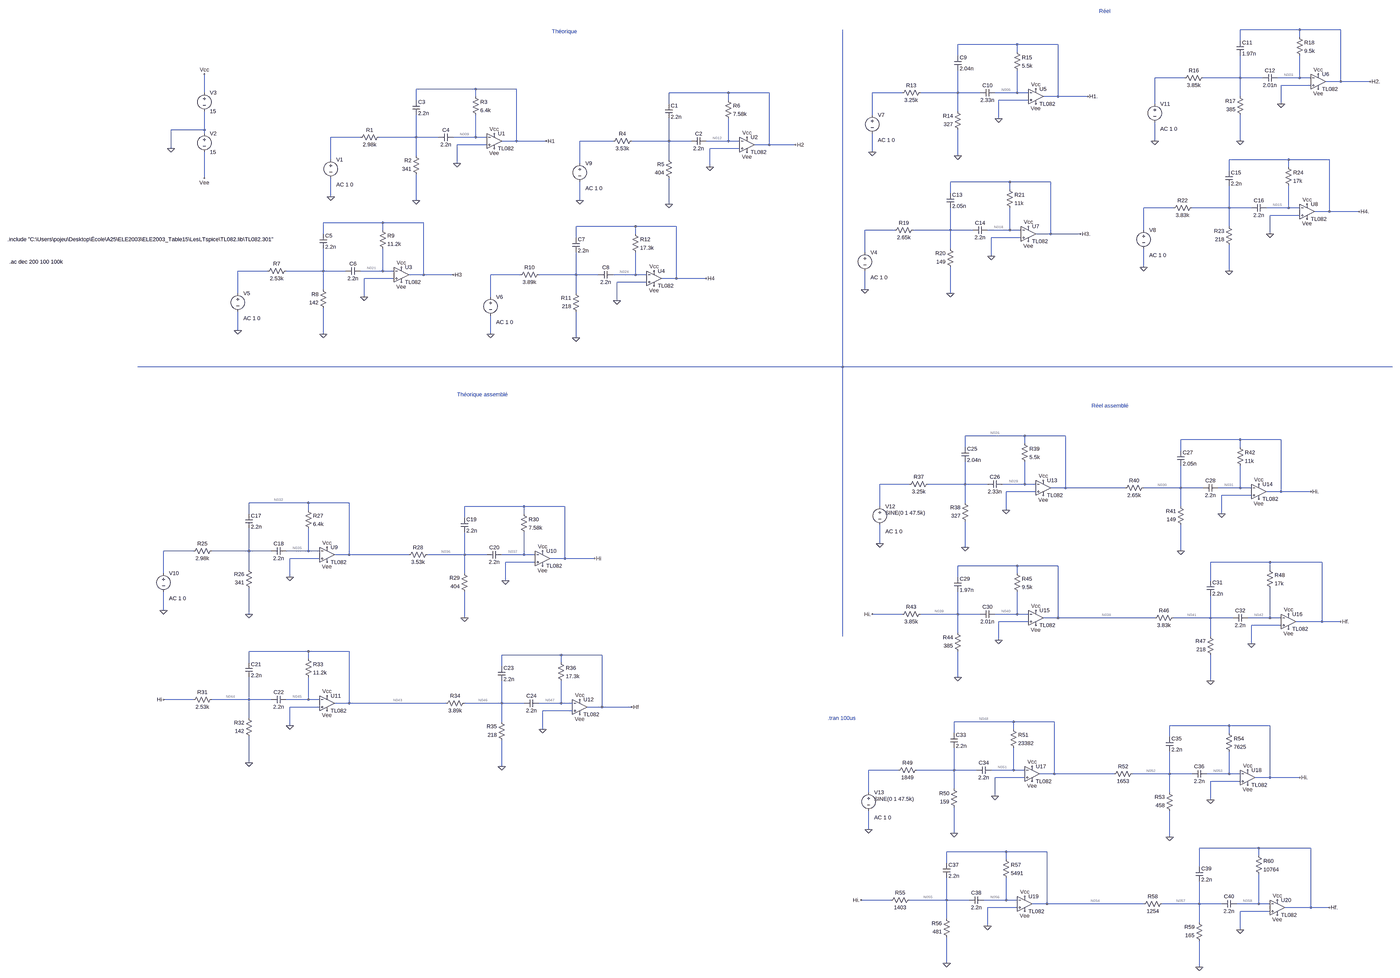
[diagram p0: schematic Filtres separes_F_wizard.asc, whole sheet]
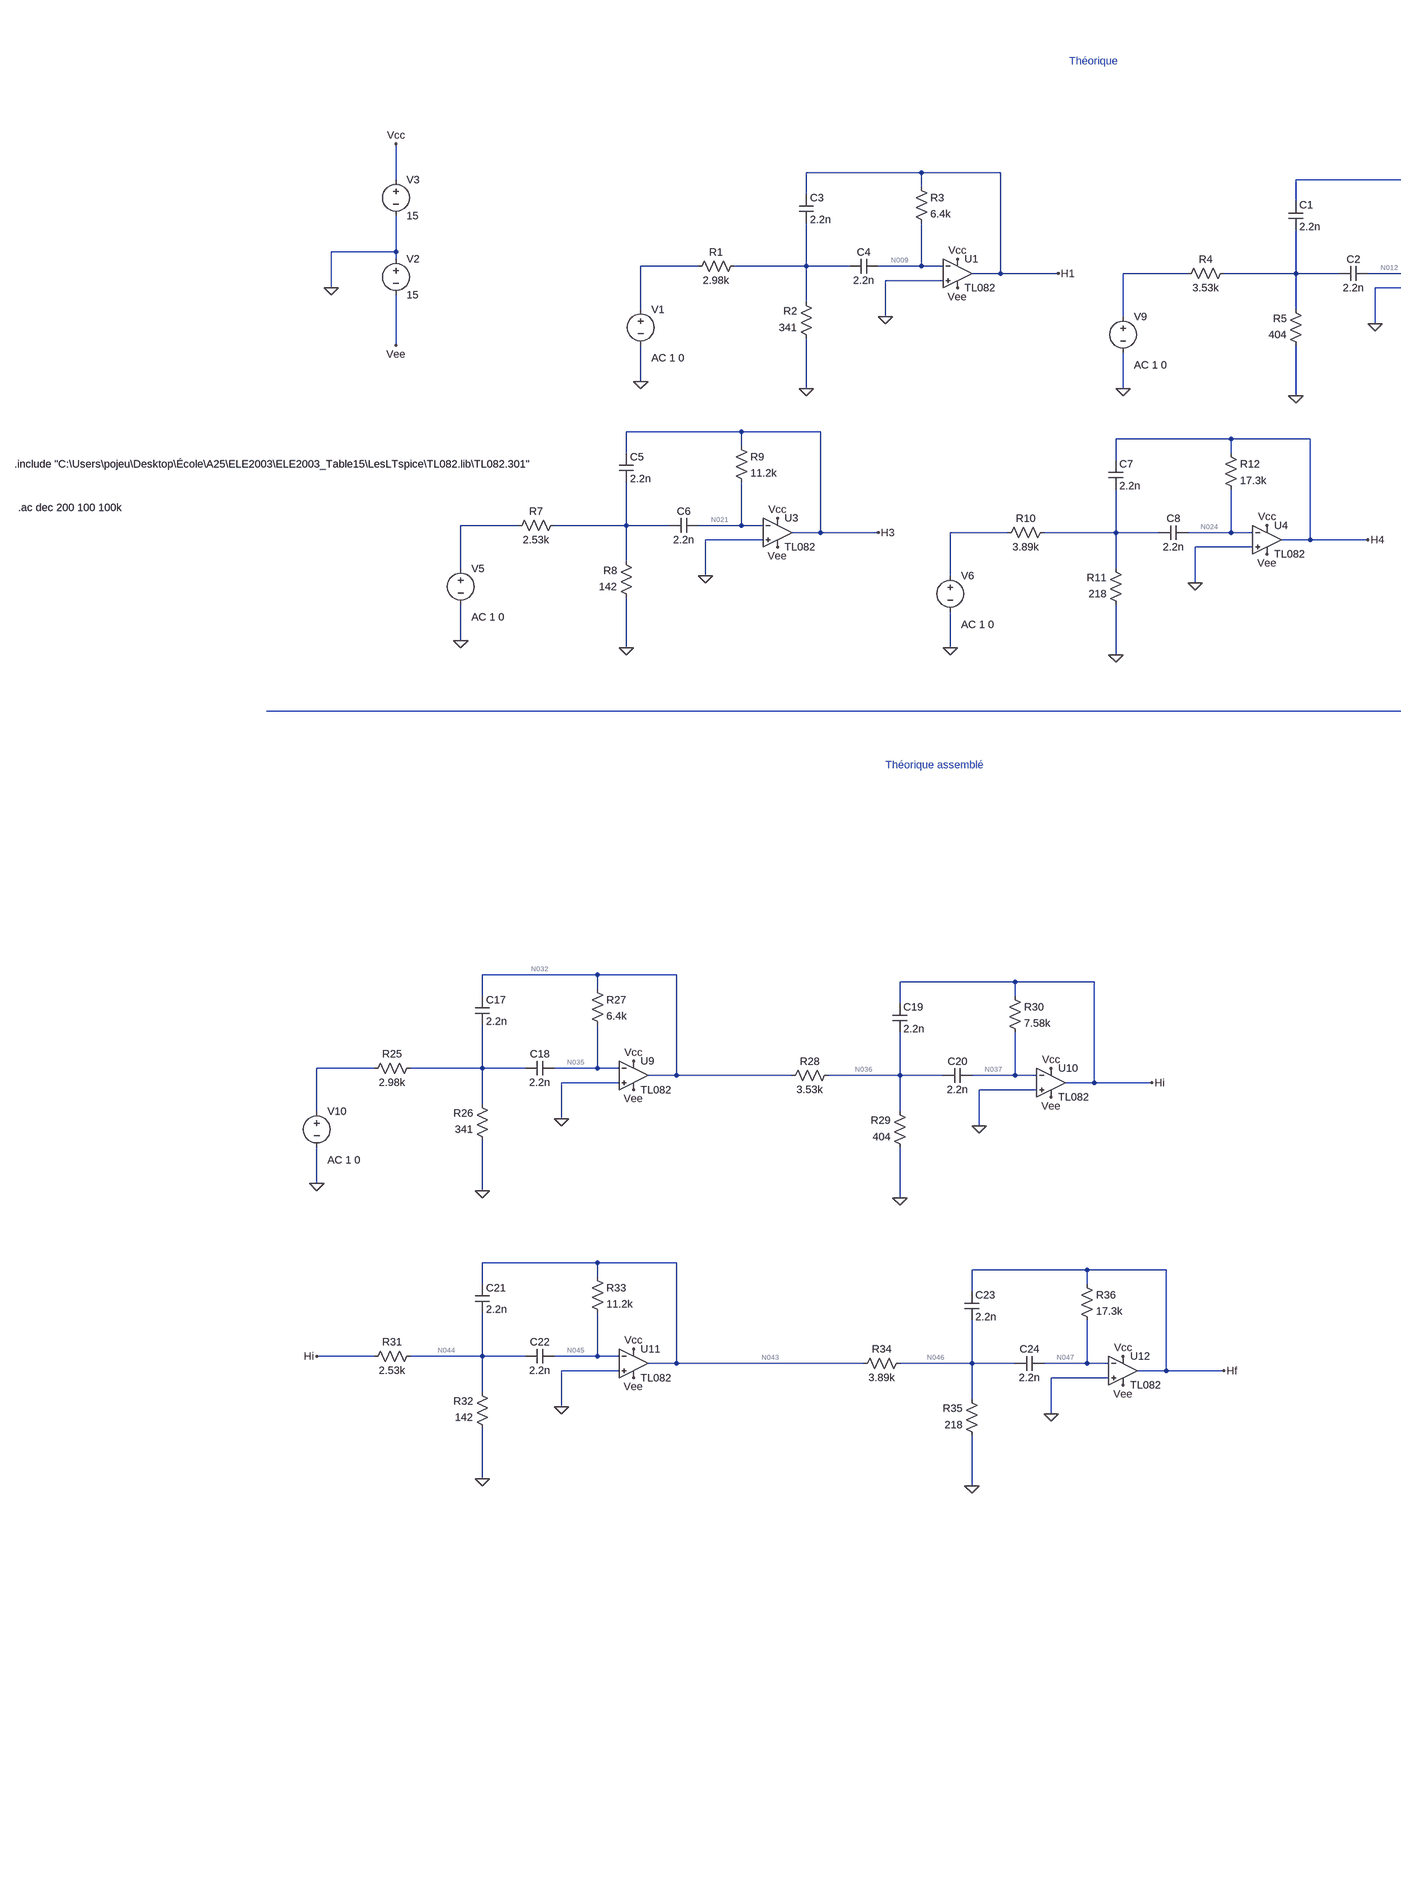
[diagram p1: schematic Filtres separes_F_wizard.asc, part, row 1 of 1, column 1 of 2]
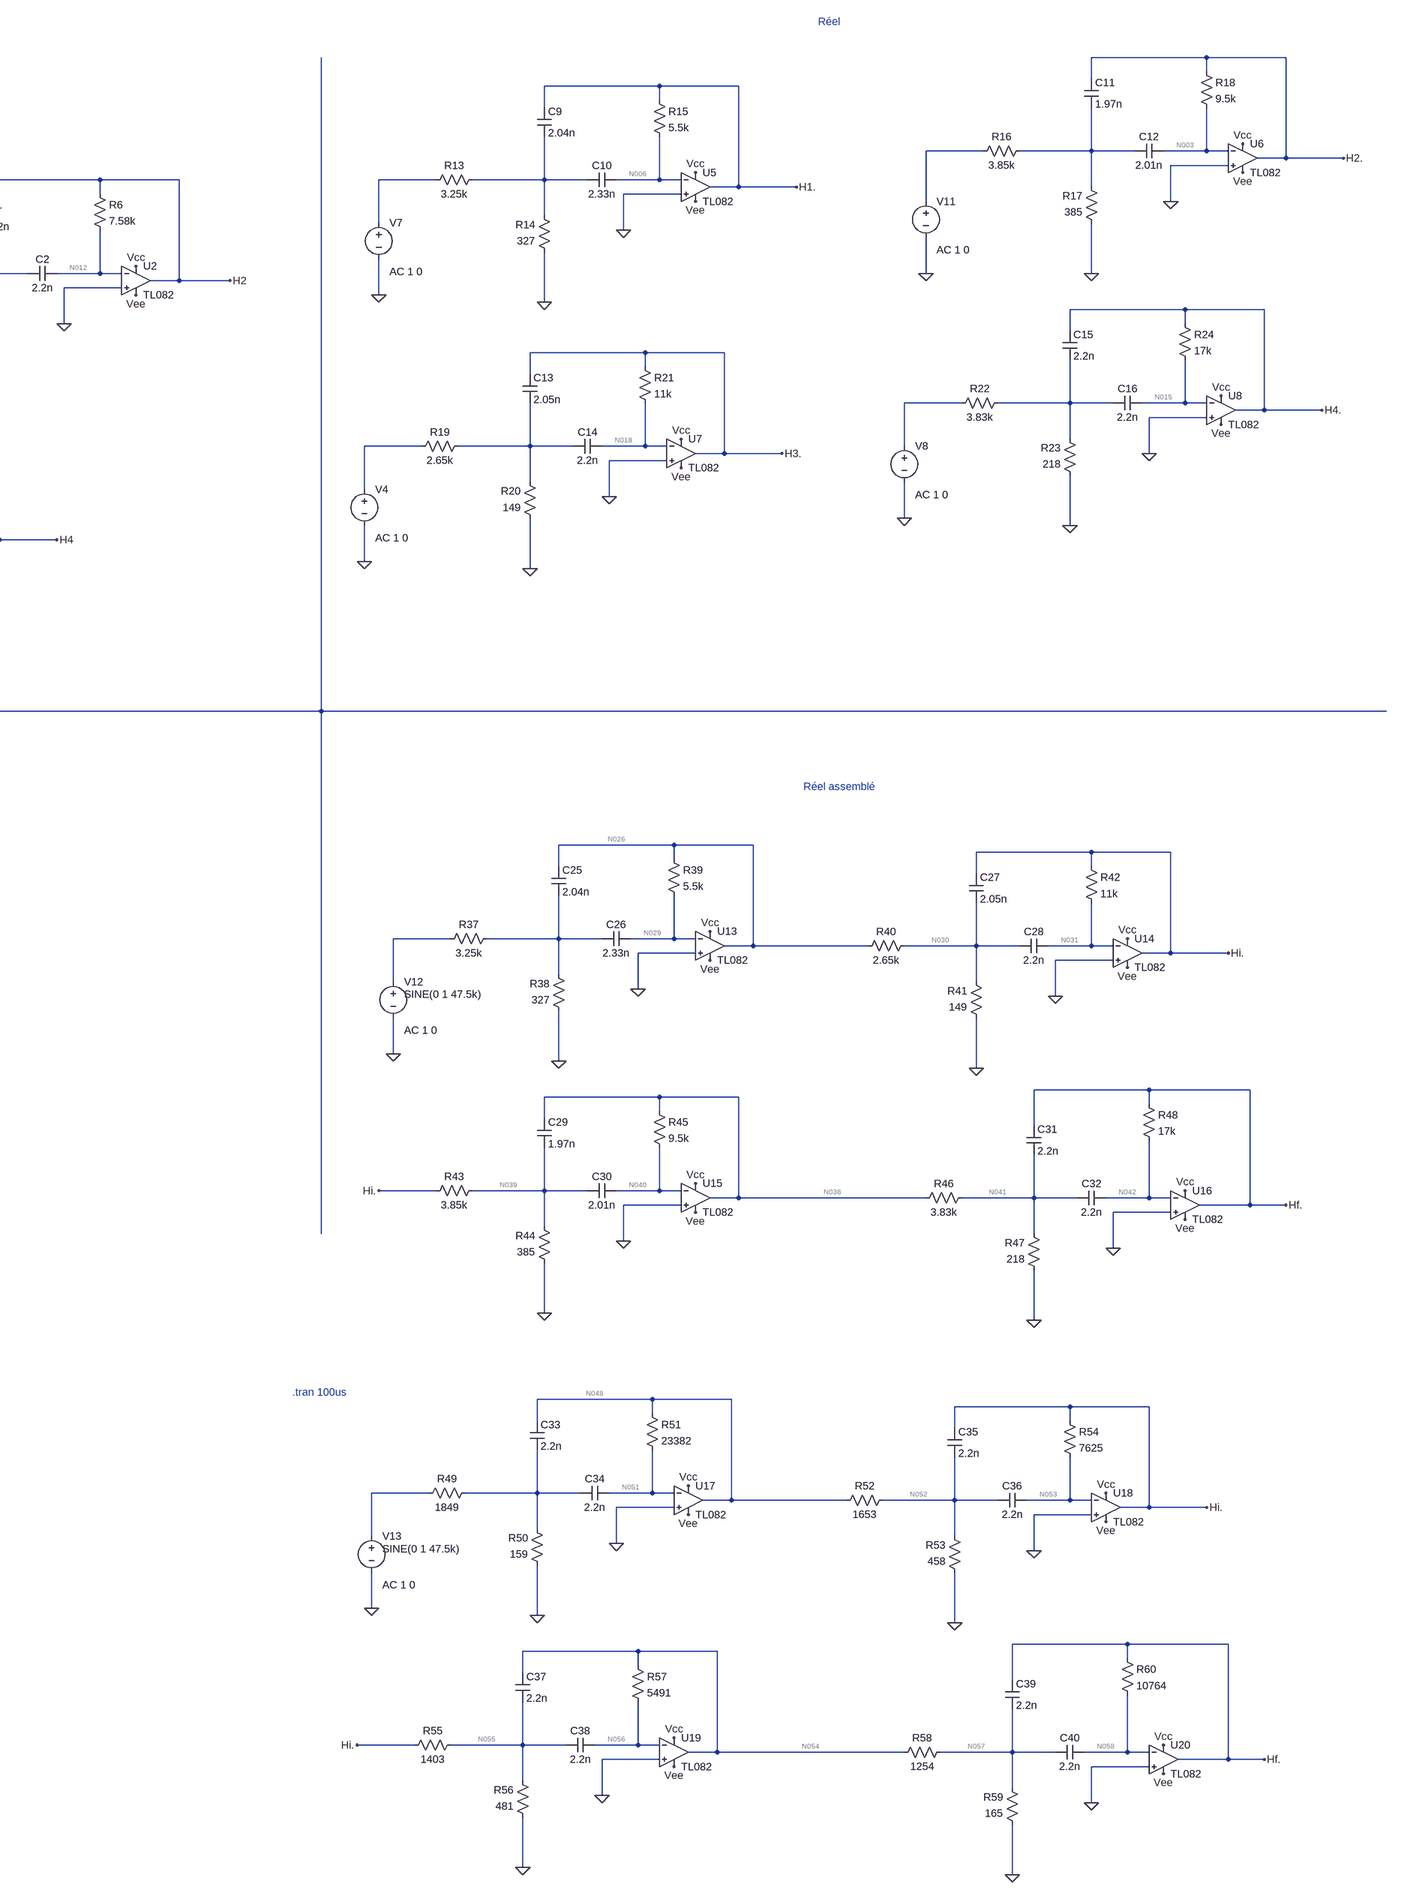
[diagram p2: schematic Filtres separes_F_wizard.asc, part, row 1 of 1, column 2 of 2]
Filtres separes_F_wizard.asc, the LTspice schematic file:
Version 4.1
SHEET 1 5816 3972
WIRE 4368 -288 4112 -288
WIRE 4544 -288 4368 -288
WIRE 4368 -256 4368 -288
WIRE 4112 -240 4112 -288
WIRE 3152 -224 2896 -224
WIRE 3328 -224 3152 -224
WIRE 3152 -192 3152 -224
WIRE 2896 -176 2896 -224
WIRE 3872 -80 3744 -80
WIRE 4112 -80 4112 -176
WIRE 4112 -80 3952 -80
WIRE 4208 -80 4112 -80
WIRE 4368 -80 4368 -176
WIRE 4368 -80 4272 -80
WIRE 4416 -80 4368 -80
WIRE 4544 -64 4544 -288
WIRE 4544 -64 4480 -64
WIRE 4672 -64 4544 -64
WIRE 4416 -48 4288 -48
WIRE 592 -32 336 -32
WIRE 768 -32 592 -32
WIRE -576 -16 -576 -96
WIRE 1680 -16 1424 -16
WIRE 1856 -16 1680 -16
WIRE 2656 -16 2528 -16
WIRE 2896 -16 2896 -112
WIRE 2896 -16 2736 -16
WIRE 2992 -16 2896 -16
WIRE 3152 -16 3152 -112
WIRE 3152 -16 3056 -16
WIRE 3200 -16 3152 -16
WIRE 592 0 592 -32
WIRE 3328 0 3328 -224
WIRE 3328 0 3264 0
WIRE 3456 0 3328 0
WIRE 4112 0 4112 -80
WIRE 336 16 336 -32
WIRE 1680 16 1680 -16
WIRE 3200 16 3072 16
WIRE 1424 32 1424 -16
WIRE 3744 32 3744 -80
WIRE 4288 32 4288 -48
WIRE 2896 64 2896 -16
WIRE 2528 80 2528 -16
WIRE 3072 96 3072 16
WIRE -576 144 -576 64
WIRE -576 144 -720 144
WIRE -576 160 -576 144
WIRE 96 176 -32 176
WIRE 336 176 336 80
WIRE 336 176 176 176
WIRE 432 176 336 176
WIRE 592 176 592 80
WIRE 592 176 496 176
WIRE 640 176 592 176
WIRE 768 192 768 -32
WIRE 768 192 704 192
WIRE 896 192 768 192
WIRE 1184 192 1040 192
WIRE 1424 192 1424 96
WIRE 1424 192 1264 192
WIRE 1520 192 1424 192
WIRE 1680 192 1680 96
WIRE 1680 192 1584 192
WIRE 1728 192 1680 192
WIRE 3744 192 3744 112
WIRE 4112 192 4112 80
WIRE 640 208 512 208
WIRE 1856 208 1856 -16
WIRE 1856 208 1792 208
WIRE 1984 208 1856 208
WIRE -720 224 -720 144
WIRE 1728 224 1600 224
WIRE 2528 240 2528 160
WIRE 336 256 336 176
WIRE 2896 256 2896 144
WIRE -32 272 -32 176
WIRE 1424 272 1424 192
WIRE 4320 272 4064 272
WIRE 4496 272 4320 272
WIRE 512 288 512 208
WIRE 1040 288 1040 192
WIRE 1600 304 1600 224
WIRE 4320 304 4320 272
WIRE 4064 320 4064 272
WIRE -576 352 -576 240
WIRE 3120 368 2864 368
WIRE 3296 368 3120 368
WIRE 3120 400 3120 368
WIRE 2864 416 2864 368
WIRE -32 432 -32 352
WIRE 336 448 336 336
WIRE 1040 448 1040 368
WIRE 1424 464 1424 352
WIRE 3824 480 3696 480
WIRE 4064 480 4064 384
WIRE 4064 480 3904 480
WIRE 4160 480 4064 480
WIRE 4320 480 4320 384
WIRE 4320 480 4224 480
WIRE 4368 480 4320 480
WIRE 4496 496 4496 272
WIRE 4496 496 4432 496
WIRE 4624 496 4496 496
WIRE 4368 512 4240 512
WIRE 192 544 -64 544
WIRE 368 544 192 544
WIRE 1280 560 1024 560
WIRE 1456 560 1280 560
WIRE 4064 560 4064 480
WIRE 192 576 192 544
WIRE 2624 576 2496 576
WIRE 2864 576 2864 480
WIRE 2864 576 2704 576
WIRE 2960 576 2864 576
WIRE 3120 576 3120 480
WIRE 3120 576 3024 576
WIRE 3168 576 3120 576
WIRE 3696 576 3696 480
WIRE -64 592 -64 544
WIRE 1280 592 1280 560
WIRE 3296 592 3296 368
WIRE 3296 592 3232 592
WIRE 3424 592 3296 592
WIRE 4240 592 4240 512
WIRE 1024 608 1024 560
WIRE 3168 608 3040 608
WIRE 2864 656 2864 576
WIRE 2496 672 2496 576
WIRE 3040 688 3040 608
WIRE 3696 736 3696 656
WIRE -304 752 -432 752
WIRE -64 752 -64 656
WIRE -64 752 -224 752
WIRE 32 752 -64 752
WIRE 192 752 192 656
WIRE 192 752 96 752
WIRE 240 752 192 752
WIRE 4064 752 4064 640
WIRE 368 768 368 544
WIRE 368 768 304 768
WIRE 496 768 368 768
WIRE 784 768 656 768
WIRE 1024 768 1024 672
WIRE 1024 768 864 768
WIRE 1120 768 1024 768
WIRE 1280 768 1280 672
WIRE 1280 768 1184 768
WIRE 1328 768 1280 768
WIRE 240 784 112 784
WIRE 1456 784 1456 560
WIRE 1456 784 1392 784
WIRE 1584 784 1456 784
WIRE 1328 800 1200 800
WIRE -64 832 -64 752
WIRE 2496 832 2496 752
WIRE -432 848 -432 752
WIRE 1024 848 1024 768
WIRE 2864 848 2864 736
WIRE 112 864 112 784
WIRE 656 864 656 768
WIRE 1200 880 1200 800
WIRE -432 1008 -432 928
WIRE -64 1024 -64 912
WIRE 656 1024 656 944
WIRE 1024 1040 1024 928
WIRE 2400 1328 2400 -288
WIRE 2400 1328 -864 1328
WIRE 4768 1328 2400 1328
WIRE 3184 1664 2928 1664
WIRE 3360 1664 3184 1664
WIRE 4112 1680 3856 1680
WIRE 4288 1680 4112 1680
WIRE 3184 1696 3184 1664
WIRE 2928 1712 2928 1664
WIRE 4112 1712 4112 1680
WIRE 3856 1728 3856 1680
WIRE 2688 1872 2560 1872
WIRE 2928 1872 2928 1776
WIRE 2928 1872 2768 1872
WIRE 3024 1872 2928 1872
WIRE 3184 1872 3184 1776
WIRE 3184 1872 3088 1872
WIRE 3232 1872 3184 1872
WIRE 3360 1888 3360 1664
WIRE 3360 1888 3296 1888
WIRE 3616 1888 3360 1888
WIRE 3856 1888 3856 1792
WIRE 3856 1888 3696 1888
WIRE 3952 1888 3856 1888
WIRE 4112 1888 4112 1792
WIRE 4112 1888 4016 1888
WIRE 4160 1888 4112 1888
WIRE 3232 1904 3104 1904
WIRE 4288 1904 4288 1680
WIRE 4288 1904 4224 1904
WIRE 4416 1904 4288 1904
WIRE 4160 1920 4032 1920
WIRE -128 1952 -384 1952
WIRE 48 1952 -128 1952
WIRE 2928 1952 2928 1872
WIRE 800 1968 544 1968
WIRE 976 1968 800 1968
WIRE 2560 1968 2560 1872
WIRE 3856 1968 3856 1888
WIRE -128 1984 -128 1952
WIRE 3104 1984 3104 1904
WIRE -384 2000 -384 1952
WIRE 800 2000 800 1968
WIRE 4032 2000 4032 1920
WIRE 544 2016 544 1968
WIRE 2560 2128 2560 2048
WIRE 2928 2144 2928 2032
WIRE -624 2160 -752 2160
WIRE -384 2160 -384 2064
WIRE -384 2160 -544 2160
WIRE -288 2160 -384 2160
WIRE -128 2160 -128 2064
WIRE -128 2160 -224 2160
WIRE -80 2160 -128 2160
WIRE 3856 2160 3856 2048
WIRE 48 2176 48 1952
WIRE 48 2176 -16 2176
WIRE 304 2176 48 2176
WIRE 544 2176 544 2080
WIRE 544 2176 384 2176
WIRE 640 2176 544 2176
WIRE 800 2176 800 2080
WIRE 800 2176 704 2176
WIRE 848 2176 800 2176
WIRE -80 2192 -208 2192
WIRE 976 2192 976 1968
WIRE 976 2192 912 2192
WIRE 1104 2192 976 2192
WIRE 848 2208 720 2208
WIRE 4240 2208 3984 2208
WIRE 4464 2208 4240 2208
WIRE 3152 2224 2896 2224
WIRE 3328 2224 3152 2224
WIRE -384 2240 -384 2160
WIRE 4240 2240 4240 2208
WIRE -752 2256 -752 2160
WIRE 544 2256 544 2176
WIRE 3152 2256 3152 2224
WIRE -208 2272 -208 2192
WIRE 2896 2272 2896 2224
WIRE 720 2288 720 2208
WIRE 3984 2288 3984 2208
WIRE -752 2416 -752 2336
WIRE -384 2432 -384 2320
WIRE 2656 2432 2528 2432
WIRE 2896 2432 2896 2336
WIRE 2896 2432 2736 2432
WIRE 2992 2432 2896 2432
WIRE 3152 2432 3152 2336
WIRE 3152 2432 3056 2432
WIRE 3200 2432 3152 2432
WIRE 544 2448 544 2336
WIRE 3328 2448 3328 2224
WIRE 3328 2448 3264 2448
WIRE 3744 2448 3328 2448
WIRE 3984 2448 3984 2352
WIRE 3984 2448 3824 2448
WIRE 4080 2448 3984 2448
WIRE 4240 2448 4240 2320
WIRE 4240 2448 4144 2448
WIRE 4288 2448 4240 2448
WIRE 3200 2464 3072 2464
WIRE 4464 2464 4464 2208
WIRE 4464 2464 4352 2464
WIRE 4544 2464 4464 2464
WIRE 4288 2480 4160 2480
WIRE 2896 2512 2896 2432
WIRE 2400 2528 2400 1328
WIRE 3984 2528 3984 2448
WIRE 3072 2544 3072 2464
WIRE 4160 2560 4160 2480
WIRE -128 2592 -384 2592
WIRE 48 2592 -128 2592
WIRE 960 2608 704 2608
WIRE 1136 2608 960 2608
WIRE -128 2624 -128 2592
WIRE -384 2640 -384 2592
WIRE 960 2640 960 2608
WIRE 704 2656 704 2608
WIRE 2896 2704 2896 2592
WIRE 3984 2720 3984 2608
WIRE -624 2800 -752 2800
WIRE -384 2800 -384 2704
WIRE -384 2800 -544 2800
WIRE -288 2800 -384 2800
WIRE -128 2800 -128 2704
WIRE -128 2800 -224 2800
WIRE -80 2800 -128 2800
WIRE 48 2816 48 2592
WIRE 48 2816 -16 2816
WIRE 464 2816 48 2816
WIRE 704 2816 704 2720
WIRE 704 2816 544 2816
WIRE 800 2816 704 2816
WIRE 960 2816 960 2720
WIRE 960 2816 864 2816
WIRE 1008 2816 960 2816
WIRE -80 2832 -208 2832
WIRE 1136 2832 1136 2608
WIRE 1136 2832 1072 2832
WIRE 1264 2832 1136 2832
WIRE 1008 2848 880 2848
WIRE -384 2880 -384 2800
WIRE 704 2896 704 2816
WIRE 3136 2896 2880 2896
WIRE 3312 2896 3136 2896
WIRE -208 2912 -208 2832
WIRE 4064 2912 3808 2912
WIRE 4240 2912 4064 2912
WIRE 880 2928 880 2848
WIRE 3136 2928 3136 2896
WIRE 2880 2944 2880 2896
WIRE 4064 2944 4064 2912
WIRE 3808 2960 3808 2912
WIRE -384 3072 -384 2960
WIRE 704 3088 704 2976
WIRE 2640 3104 2512 3104
WIRE 2880 3104 2880 3008
WIRE 2880 3104 2720 3104
WIRE 2976 3104 2880 3104
WIRE 3136 3104 3136 3008
WIRE 3136 3104 3040 3104
WIRE 3184 3104 3136 3104
WIRE 3312 3120 3312 2896
WIRE 3312 3120 3248 3120
WIRE 3568 3120 3312 3120
WIRE 3808 3120 3808 3024
WIRE 3808 3120 3648 3120
WIRE 3904 3120 3808 3120
WIRE 4064 3120 4064 3024
WIRE 4064 3120 3968 3120
WIRE 4112 3120 4064 3120
WIRE 3184 3136 3056 3136
WIRE 4240 3136 4240 2912
WIRE 4240 3136 4176 3136
WIRE 4368 3136 4240 3136
WIRE 4112 3152 3984 3152
WIRE 2880 3184 2880 3104
WIRE 2512 3200 2512 3104
WIRE 3808 3200 3808 3120
WIRE 3056 3216 3056 3136
WIRE 3984 3232 3984 3152
WIRE 2512 3360 2512 3280
WIRE 2880 3376 2880 3264
WIRE 3808 3392 3808 3280
WIRE 4192 3440 3936 3440
WIRE 4416 3440 4192 3440
WIRE 3104 3456 2848 3456
WIRE 3280 3456 3104 3456
WIRE 4192 3472 4192 3440
WIRE 3104 3488 3104 3456
WIRE 2848 3504 2848 3456
WIRE 3936 3520 3936 3440
WIRE 2608 3664 2480 3664
WIRE 2848 3664 2848 3568
WIRE 2848 3664 2688 3664
WIRE 2944 3664 2848 3664
WIRE 3104 3664 3104 3568
WIRE 3104 3664 3008 3664
WIRE 3152 3664 3104 3664
WIRE 3280 3680 3280 3456
WIRE 3280 3680 3216 3680
WIRE 3696 3680 3280 3680
WIRE 3936 3680 3936 3584
WIRE 3936 3680 3776 3680
WIRE 4032 3680 3936 3680
WIRE 4192 3680 4192 3552
WIRE 4192 3680 4096 3680
WIRE 4240 3680 4192 3680
WIRE 3152 3696 3024 3696
WIRE 4416 3696 4416 3440
WIRE 4416 3696 4304 3696
WIRE 4496 3696 4416 3696
WIRE 4240 3712 4112 3712
WIRE 2848 3744 2848 3664
WIRE 3936 3760 3936 3680
WIRE 3024 3776 3024 3696
WIRE 4112 3792 4112 3712
WIRE 2848 3936 2848 3824
WIRE 3936 3952 3936 3840
FLAG 336 448 0
FLAG -32 432 0
FLAG -720 224 0
FLAG -576 -96 Vcc
FLAG -576 352 Vee
FLAG 672 160 Vcc
FLAG 672 224 Vee
FLAG 512 288 0
FLAG 1424 464 0
FLAG 1760 176 Vcc
FLAG 1760 240 Vee
FLAG 1600 304 0
FLAG -64 1024 0
FLAG -432 1008 0
FLAG 272 736 Vcc
FLAG 272 800 Vee
FLAG 112 864 0
FLAG 1024 1040 0
FLAG 656 1024 0
FLAG 1360 752 Vcc
FLAG 1360 816 Vee
FLAG 1200 880 0
FLAG 896 192 H1
FLAG 1984 208 H2
FLAG 496 768 H3
FLAG 1584 784 H4
FLAG 2896 256 0
FLAG 2528 240 0
FLAG 3232 -32 Vcc
FLAG 3232 32 Vee
FLAG 3072 96 0
FLAG 3456 0 H1.
FLAG 4112 192 0
FLAG 4448 -96 Vcc
FLAG 4448 -32 Vee
FLAG 4288 32 0
FLAG 4672 -64 H2.
FLAG 2864 848 0
FLAG 2496 832 0
FLAG 3200 560 Vcc
FLAG 3200 624 Vee
FLAG 3040 688 0
FLAG 3424 592 H3.
FLAG 4064 752 0
FLAG 3696 736 0
FLAG 4400 464 Vcc
FLAG 4400 528 Vee
FLAG 4240 592 0
FLAG 4624 496 H4.
FLAG 1040 448 0
FLAG -384 2432 0
FLAG -752 2416 0
FLAG -48 2144 Vcc
FLAG -48 2208 Vee
FLAG -208 2272 0
FLAG 544 2448 0
FLAG 880 2160 Vcc
FLAG 880 2224 Vee
FLAG 720 2288 0
FLAG 1104 2192 Hi
FLAG -384 3072 0
FLAG -48 2784 Vcc
FLAG -48 2848 Vee
FLAG -208 2912 0
FLAG 704 3088 0
FLAG 1040 2800 Vcc
FLAG 1040 2864 Vee
FLAG 880 2928 0
FLAG 1264 2832 Hf
FLAG 3744 192 0
FLAG 2928 2144 0
FLAG 2560 2128 0
FLAG 3264 1856 Vcc
FLAG 3264 1920 Vee
FLAG 3104 1984 0
FLAG 3856 2160 0
FLAG 4192 1872 Vcc
FLAG 4192 1936 Vee
FLAG 4032 2000 0
FLAG 4416 1904 Hi.
FLAG 2896 2704 0
FLAG 3232 2416 Vcc
FLAG 3232 2480 Vee
FLAG 3072 2544 0
FLAG 3984 2720 0
FLAG 4320 2432 Vcc
FLAG 4320 2496 Vee
FLAG 4160 2560 0
FLAG 2528 2432 Hi.
FLAG 4544 2464 Hf.
FLAG -752 2800 Hi
FLAG 2880 3376 0
FLAG 2512 3360 0
FLAG 3216 3088 Vcc
FLAG 3216 3152 Vee
FLAG 3056 3216 0
FLAG 3808 3392 0
FLAG 4144 3104 Vcc
FLAG 4144 3168 Vee
FLAG 3984 3232 0
FLAG 4368 3136 Hi.
FLAG 2848 3936 0
FLAG 3184 3648 Vcc
FLAG 3184 3712 Vee
FLAG 3024 3776 0
FLAG 3936 3952 0
FLAG 4272 3664 Vcc
FLAG 4272 3728 Vee
FLAG 4112 3792 0
FLAG 2480 3664 Hi.
FLAG 4496 3696 Hf.
SYMBOL res 192 160 R90
WINDOW 0 0 56 VBottom 2
WINDOW 3 32 56 VTop 2
SYMATTR InstName R1
SYMATTR Value 2.98k
SYMBOL res 352 352 R180
WINDOW 0 36 76 Left 2
WINDOW 3 36 40 Left 2
SYMATTR InstName R2
SYMATTR Value 341
SYMBOL cap 320 16 R0
SYMATTR InstName C3
SYMATTR Value 2.2n
SYMBOL cap 496 160 R90
WINDOW 0 0 32 VBottom 2
WINDOW 3 32 32 VTop 2
SYMATTR InstName C4
SYMATTR Value 2.2n
SYMBOL res 576 -16 R0
SYMATTR InstName R3
SYMATTR Value 6.4k
SYMBOL voltage -32 256 R0
WINDOW 123 24 124 Left 2
WINDOW 39 0 0 Left 0
SYMATTR Value2 AC 1 0
SYMATTR InstName V1
SYMATTR Value ""
SYMBOL voltage -576 144 R0
SYMATTR InstName V2
SYMATTR Value 15
SYMBOL voltage -576 -32 R0
SYMATTR InstName V3
SYMATTR Value 15
SYMBOL OpAmps\\opamp2 672 128 R0
SYMATTR InstName U1
SYMATTR Value TL082
SYMBOL res 1280 176 R90
WINDOW 0 0 56 VBottom 2
WINDOW 3 32 56 VTop 2
SYMATTR InstName R4
SYMATTR Value 3.53k
SYMBOL res 1440 368 R180
WINDOW 0 36 76 Left 2
WINDOW 3 36 40 Left 2
SYMATTR InstName R5
SYMATTR Value 404
SYMBOL cap 1408 32 R0
SYMATTR InstName C1
SYMATTR Value 2.2n
SYMBOL cap 1584 176 R90
WINDOW 0 0 32 VBottom 2
WINDOW 3 32 32 VTop 2
SYMATTR InstName C2
SYMATTR Value 2.2n
SYMBOL res 1664 0 R0
SYMATTR InstName R6
SYMATTR Value 7.58k
SYMBOL OpAmps\\opamp2 1760 144 R0
SYMATTR InstName U2
SYMATTR Value TL082
SYMBOL res -208 736 R90
WINDOW 0 0 56 VBottom 2
WINDOW 3 32 56 VTop 2
SYMATTR InstName R7
SYMATTR Value 2.53k
SYMBOL res -48 928 R180
WINDOW 0 36 76 Left 2
WINDOW 3 36 40 Left 2
SYMATTR InstName R8
SYMATTR Value 142
SYMBOL cap -80 592 R0
SYMATTR InstName C5
SYMATTR Value 2.2n
SYMBOL cap 96 736 R90
WINDOW 0 0 32 VBottom 2
WINDOW 3 32 32 VTop 2
SYMATTR InstName C6
SYMATTR Value 2.2n
SYMBOL res 176 560 R0
SYMATTR InstName R9
SYMATTR Value 11.2k
SYMBOL voltage -432 832 R0
WINDOW 123 24 124 Left 2
WINDOW 39 0 0 Left 0
SYMATTR Value2 AC 1 0
SYMATTR InstName V5
SYMATTR Value ""
SYMBOL OpAmps\\opamp2 272 704 R0
SYMATTR InstName U3
SYMATTR Value TL082
SYMBOL res 880 752 R90
WINDOW 0 0 56 VBottom 2
WINDOW 3 32 56 VTop 2
SYMATTR InstName R10
SYMATTR Value 3.89k
SYMBOL res 1040 944 R180
WINDOW 0 36 76 Left 2
WINDOW 3 36 40 Left 2
SYMATTR InstName R11
SYMATTR Value 218
SYMBOL cap 1008 608 R0
SYMATTR InstName C7
SYMATTR Value 2.2n
SYMBOL cap 1184 752 R90
WINDOW 0 0 32 VBottom 2
WINDOW 3 32 32 VTop 2
SYMATTR InstName C8
SYMATTR Value 2.2n
SYMBOL res 1264 576 R0
SYMATTR InstName R12
SYMATTR Value 17.3k
SYMBOL voltage 656 848 R0
WINDOW 123 24 124 Left 2
WINDOW 39 0 0 Left 0
SYMATTR Value2 AC 1 0
SYMATTR InstName V6
SYMATTR Value ""
SYMBOL OpAmps\\opamp2 1360 720 R0
SYMATTR InstName U4
SYMATTR Value TL082
SYMBOL res 2752 -32 R90
WINDOW 0 0 56 VBottom 2
WINDOW 3 32 56 VTop 2
SYMATTR InstName R13
SYMATTR Value 3.25k
SYMBOL res 2912 160 R180
WINDOW 0 36 76 Left 2
WINDOW 3 36 40 Left 2
SYMATTR InstName R14
SYMATTR Value 327
SYMBOL cap 2880 -176 R0
SYMATTR InstName C9
SYMATTR Value 2.04n
SYMBOL cap 3056 -32 R90
WINDOW 0 0 32 VBottom 2
WINDOW 3 32 32 VTop 2
SYMATTR InstName C10
SYMATTR Value 2.33n
SYMBOL res 3136 -208 R0
SYMATTR InstName R15
SYMATTR Value 5.5k
SYMBOL voltage 2528 64 R0
WINDOW 123 24 124 Left 2
WINDOW 39 0 0 Left 0
SYMATTR Value2 AC 1 0
SYMATTR InstName V7
SYMATTR Value ""
SYMBOL OpAmps\\opamp2 3232 -64 R0
SYMATTR InstName U5
SYMATTR Value TL082
SYMBOL res 3968 -96 R90
WINDOW 0 0 56 VBottom 2
WINDOW 3 32 56 VTop 2
SYMATTR InstName R16
SYMATTR Value 3.85k
SYMBOL res 4128 96 R180
WINDOW 0 36 76 Left 2
WINDOW 3 36 40 Left 2
SYMATTR InstName R17
SYMATTR Value 385
SYMBOL cap 4096 -240 R0
SYMATTR InstName C11
SYMATTR Value 1.97n
SYMBOL cap 4272 -96 R90
WINDOW 0 0 32 VBottom 2
WINDOW 3 32 32 VTop 2
SYMATTR InstName C12
SYMATTR Value 2.01n
SYMBOL res 4352 -272 R0
SYMATTR InstName R18
SYMATTR Value 9.5k
SYMBOL OpAmps\\opamp2 4448 -128 R0
SYMATTR InstName U6
SYMATTR Value TL082
SYMBOL res 2720 560 R90
WINDOW 0 0 56 VBottom 2
WINDOW 3 32 56 VTop 2
SYMATTR InstName R19
SYMATTR Value 2.65k
SYMBOL res 2880 752 R180
WINDOW 0 36 76 Left 2
WINDOW 3 36 40 Left 2
SYMATTR InstName R20
SYMATTR Value 149
SYMBOL cap 2848 416 R0
SYMATTR InstName C13
SYMATTR Value 2.05n
SYMBOL cap 3024 560 R90
WINDOW 0 0 32 VBottom 2
WINDOW 3 32 32 VTop 2
SYMATTR InstName C14
SYMATTR Value 2.2n
SYMBOL res 3104 384 R0
SYMATTR InstName R21
SYMATTR Value 11k
SYMBOL voltage 2496 656 R0
WINDOW 123 24 124 Left 2
WINDOW 39 0 0 Left 0
SYMATTR Value2 AC 1 0
SYMATTR InstName V4
SYMATTR Value ""
SYMBOL OpAmps\\opamp2 3200 528 R0
SYMATTR InstName U7
SYMATTR Value TL082
SYMBOL res 3920 464 R90
WINDOW 0 0 56 VBottom 2
WINDOW 3 32 56 VTop 2
SYMATTR InstName R22
SYMATTR Value 3.83k
SYMBOL res 4080 656 R180
WINDOW 0 36 76 Left 2
WINDOW 3 36 40 Left 2
SYMATTR InstName R23
SYMATTR Value 218
SYMBOL cap 4048 320 R0
SYMATTR InstName C15
SYMATTR Value 2.2n
SYMBOL cap 4224 464 R90
WINDOW 0 0 32 VBottom 2
WINDOW 3 32 32 VTop 2
SYMATTR InstName C16
SYMATTR Value 2.2n
SYMBOL res 4304 288 R0
SYMATTR InstName R24
SYMATTR Value 17k
SYMBOL voltage 3696 560 R0
WINDOW 123 24 124 Left 2
WINDOW 39 0 0 Left 0
SYMATTR Value2 AC 1 0
SYMATTR InstName V8
SYMATTR Value ""
SYMBOL OpAmps\\opamp2 4400 432 R0
SYMATTR InstName U8
SYMATTR Value TL082
SYMBOL voltage 1040 272 R0
WINDOW 123 24 124 Left 2
WINDOW 39 0 0 Left 0
SYMATTR Value2 AC 1 0
SYMATTR InstName V9
SYMATTR Value ""
SYMBOL res -528 2144 R90
WINDOW 0 0 56 VBottom 2
WINDOW 3 32 56 VTop 2
SYMATTR InstName R25
SYMATTR Value 2.98k
SYMBOL res -368 2336 R180
WINDOW 0 36 76 Left 2
WINDOW 3 36 40 Left 2
SYMATTR InstName R26
SYMATTR Value 341
SYMBOL cap -400 2000 R0
SYMATTR InstName C17
SYMATTR Value 2.2n
SYMBOL cap -224 2144 R90
WINDOW 0 0 32 VBottom 2
WINDOW 3 32 32 VTop 2
SYMATTR InstName C18
SYMATTR Value 2.2n
SYMBOL res -144 1968 R0
SYMATTR InstName R27
SYMATTR Value 6.4k
SYMBOL voltage -752 2240 R0
WINDOW 123 24 124 Left 2
WINDOW 39 0 0 Left 0
SYMATTR Value2 AC 1 0
SYMATTR InstName V10
SYMATTR Value ""
SYMBOL OpAmps\\opamp2 -48 2112 R0
SYMATTR InstName U9
SYMATTR Value TL082
SYMBOL res 400 2160 R90
WINDOW 0 0 56 VBottom 2
WINDOW 3 32 56 VTop 2
SYMATTR InstName R28
SYMATTR Value 3.53k
SYMBOL res 560 2352 R180
WINDOW 0 36 76 Left 2
WINDOW 3 36 40 Left 2
SYMATTR InstName R29
SYMATTR Value 404
SYMBOL cap 528 2016 R0
SYMATTR InstName C19
SYMATTR Value 2.2n
SYMBOL cap 704 2160 R90
WINDOW 0 0 32 VBottom 2
WINDOW 3 32 32 VTop 2
SYMATTR InstName C20
SYMATTR Value 2.2n
SYMBOL res 784 1984 R0
SYMATTR InstName R30
SYMATTR Value 7.58k
SYMBOL OpAmps\\opamp2 880 2128 R0
SYMATTR InstName U10
SYMATTR Value TL082
SYMBOL res -528 2784 R90
WINDOW 0 0 56 VBottom 2
WINDOW 3 32 56 VTop 2
SYMATTR InstName R31
SYMATTR Value 2.53k
SYMBOL res -368 2976 R180
WINDOW 0 36 76 Left 2
WINDOW 3 36 40 Left 2
SYMATTR InstName R32
SYMATTR Value 142
SYMBOL cap -400 2640 R0
SYMATTR InstName C21
SYMATTR Value 2.2n
SYMBOL cap -224 2784 R90
WINDOW 0 0 32 VBottom 2
WINDOW 3 32 32 VTop 2
SYMATTR InstName C22
SYMATTR Value 2.2n
SYMBOL res -144 2608 R0
SYMATTR InstName R33
SYMATTR Value 11.2k
SYMBOL OpAmps\\opamp2 -48 2752 R0
SYMATTR InstName U11
SYMATTR Value TL082
SYMBOL res 560 2800 R90
WINDOW 0 0 56 VBottom 2
WINDOW 3 32 56 VTop 2
SYMATTR InstName R34
SYMATTR Value 3.89k
SYMBOL res 720 2992 R180
WINDOW 0 36 76 Left 2
WINDOW 3 36 40 Left 2
SYMATTR InstName R35
SYMATTR Value 218
SYMBOL cap 688 2656 R0
SYMATTR InstName C23
SYMATTR Value 2.2n
SYMBOL cap 864 2800 R90
WINDOW 0 0 32 VBottom 2
WINDOW 3 32 32 VTop 2
SYMATTR InstName C24
SYMATTR Value 2.2n
SYMBOL res 944 2624 R0
SYMATTR InstName R36
SYMATTR Value 17.3k
SYMBOL OpAmps\\opamp2 1040 2768 R0
SYMATTR InstName U12
SYMATTR Value TL082
SYMBOL voltage 3744 16 R0
WINDOW 123 24 124 Left 2
WINDOW 39 0 0 Left 0
SYMATTR Value2 AC 1 0
SYMATTR InstName V11
SYMATTR Value ""
SYMBOL res 2784 1856 R90
WINDOW 0 0 56 VBottom 2
WINDOW 3 32 56 VTop 2
SYMATTR InstName R37
SYMATTR Value 3.25k
SYMBOL res 2944 2048 R180
WINDOW 0 36 76 Left 2
WINDOW 3 36 40 Left 2
SYMATTR InstName R38
SYMATTR Value 327
SYMBOL cap 2912 1712 R0
SYMATTR InstName C25
SYMATTR Value 2.04n
SYMBOL cap 3088 1856 R90
WINDOW 0 0 32 VBottom 2
WINDOW 3 32 32 VTop 2
SYMATTR InstName C26
SYMATTR Value 2.33n
SYMBOL res 3168 1680 R0
SYMATTR InstName R39
SYMATTR Value 5.5k
SYMBOL voltage 2560 1952 R0
WINDOW 123 24 124 Left 2
WINDOW 39 0 0 Left 0
WINDOW 3 24 44 Left 2
SYMATTR Value2 AC 1 0
SYMATTR Value SINE(0 1 47.5k)
SYMATTR InstName V12
SYMBOL OpAmps\\opamp2 3264 1824 R0
SYMATTR InstName U13
SYMATTR Value TL082
SYMBOL res 3712 1872 R90
WINDOW 0 0 56 VBottom 2
WINDOW 3 32 56 VTop 2
SYMATTR InstName R40
SYMATTR Value 2.65k
SYMBOL res 3872 2064 R180
WINDOW 0 36 76 Left 2
WINDOW 3 36 40 Left 2
SYMATTR InstName R41
SYMATTR Value 149
SYMBOL cap 3840 1728 R0
SYMATTR InstName C27
SYMATTR Value 2.05n
SYMBOL cap 4016 1872 R90
WINDOW 0 0 32 VBottom 2
WINDOW 3 32 32 VTop 2
SYMATTR InstName C28
SYMATTR Value 2.2n
SYMBOL res 4096 1696 R0
SYMATTR InstName R42
SYMATTR Value 11k
SYMBOL OpAmps\\opamp2 4192 1840 R0
SYMATTR InstName U14
SYMATTR Value TL082
SYMBOL res 2752 2416 R90
WINDOW 0 0 56 VBottom 2
WINDOW 3 32 56 VTop 2
SYMATTR InstName R43
SYMATTR Value 3.85k
SYMBOL res 2912 2608 R180
WINDOW 0 36 76 Left 2
WINDOW 3 36 40 Left 2
SYMATTR InstName R44
SYMATTR Value 385
SYMBOL cap 2880 2272 R0
SYMATTR InstName C29
SYMATTR Value 1.97n
SYMBOL cap 3056 2416 R90
WINDOW 0 0 32 VBottom 2
WINDOW 3 32 32 VTop 2
SYMATTR InstName C30
SYMATTR Value 2.01n
SYMBOL res 3136 2240 R0
SYMATTR InstName R45
SYMATTR Value 9.5k
SYMBOL OpAmps\\opamp2 3232 2384 R0
SYMATTR InstName U15
SYMATTR Value TL082
SYMBOL res 3840 2432 R90
WINDOW 0 0 56 VBottom 2
WINDOW 3 32 56 VTop 2
SYMATTR InstName R46
SYMATTR Value 3.83k
SYMBOL res 4000 2624 R180
WINDOW 0 36 76 Left 2
WINDOW 3 36 40 Left 2
SYMATTR InstName R47
SYMATTR Value 218
SYMBOL cap 3968 2288 R0
SYMATTR InstName C31
SYMATTR Value 2.2n
SYMBOL cap 4144 2432 R90
WINDOW 0 0 32 VBottom 2
WINDOW 3 32 32 VTop 2
SYMATTR InstName C32
SYMATTR Value 2.2n
SYMBOL OpAmps\\opamp2 4320 2400 R0
SYMATTR InstName U16
SYMATTR Value TL082
SYMBOL res 4224 2224 R0
SYMATTR InstName R48
SYMATTR Value 17k
SYMBOL res 2736 3088 R90
WINDOW 0 0 56 VBottom 2
WINDOW 3 32 56 VTop 2
SYMATTR InstName R49
SYMATTR Value 1849
SYMBOL res 2896 3280 R180
WINDOW 0 36 76 Left 2
WINDOW 3 36 40 Left 2
SYMATTR InstName R50
SYMATTR Value 159
SYMBOL cap 2864 2944 R0
SYMATTR InstName C33
SYMATTR Value 2.2n
SYMBOL cap 3040 3088 R90
WINDOW 0 0 32 VBottom 2
WINDOW 3 32 32 VTop 2
SYMATTR InstName C34
SYMATTR Value 2.2n
SYMBOL res 3120 2912 R0
SYMATTR InstName R51
SYMATTR Value 23382
SYMBOL voltage 2512 3184 R0
WINDOW 123 24 124 Left 2
WINDOW 39 0 0 Left 0
WINDOW 3 24 44 Left 2
SYMATTR Value2 AC 1 0
SYMATTR Value SINE(0 1 47.5k)
SYMATTR InstName V13
SYMBOL OpAmps\\opamp2 3216 3056 R0
SYMATTR InstName U17
SYMATTR Value TL082
SYMBOL res 3664 3104 R90
WINDOW 0 0 56 VBottom 2
WINDOW 3 32 56 VTop 2
SYMATTR InstName R52
SYMATTR Value 1653
SYMBOL res 3824 3296 R180
WINDOW 0 36 76 Left 2
WINDOW 3 36 40 Left 2
SYMATTR InstName R53
SYMATTR Value 458
SYMBOL cap 3792 2960 R0
SYMATTR InstName C35
SYMATTR Value 2.2n
SYMBOL cap 3968 3104 R90
WINDOW 0 0 32 VBottom 2
WINDOW 3 32 32 VTop 2
SYMATTR InstName C36
SYMATTR Value 2.2n
SYMBOL res 4048 2928 R0
SYMATTR InstName R54
SYMATTR Value 7625
SYMBOL OpAmps\\opamp2 4144 3072 R0
SYMATTR InstName U18
SYMATTR Value TL082
SYMBOL res 2704 3648 R90
WINDOW 0 0 56 VBottom 2
WINDOW 3 32 56 VTop 2
SYMATTR InstName R55
SYMATTR Value 1403
SYMBOL res 2864 3840 R180
WINDOW 0 36 76 Left 2
WINDOW 3 36 40 Left 2
SYMATTR InstName R56
SYMATTR Value 481
SYMBOL cap 2832 3504 R0
SYMATTR InstName C37
SYMATTR Value 2.2n
SYMBOL cap 3008 3648 R90
WINDOW 0 0 32 VBottom 2
WINDOW 3 32 32 VTop 2
SYMATTR InstName C38
SYMATTR Value 2.2n
SYMBOL res 3088 3472 R0
SYMATTR InstName R57
SYMATTR Value 5491
SYMBOL OpAmps\\opamp2 3184 3616 R0
SYMATTR InstName U19
SYMATTR Value TL082
SYMBOL res 3792 3664 R90
WINDOW 0 0 56 VBottom 2
WINDOW 3 32 56 VTop 2
SYMATTR InstName R58
SYMATTR Value 1254
SYMBOL res 3952 3856 R180
WINDOW 0 36 76 Left 2
WINDOW 3 36 40 Left 2
SYMATTR InstName R59
SYMATTR Value 165
SYMBOL cap 3920 3520 R0
SYMATTR InstName C39
SYMATTR Value 2.2n
SYMBOL cap 4096 3664 R90
WINDOW 0 0 32 VBottom 2
WINDOW 3 32 32 VTop 2
SYMATTR InstName C40
SYMATTR Value 2.2n
SYMBOL OpAmps\\opamp2 4272 3632 R0
SYMATTR InstName U20
SYMATTR Value TL082
SYMBOL res 4176 3456 R0
SYMATTR InstName R60
SYMATTR Value 10764
TEXT -1424 616 Left 2 !.include "C:\\Users\\pojeu\\Desktop\\École\\A25\\ELE2003\\ELE2003_Table15\\LesLTspice\\TL082.lib\\TL082.301"
TEXT -1416 712 Left 2 !.ac dec 200 100 100k
TEXT 920 -280 Left 2 ;Théorique
TEXT 3504 -368 Left 2 ;Réel
TEXT 512 1456 Left 2 ;Théorique assemblé
TEXT 3472 1504 Left 2 ;Réel assemblé
TEXT 2336 2880 Left 2 ;.tran 100us

The netlist it stands for:
* Filtres separes_F_wizard.asc
R1 N008 N007 2.98k
R2 0 N008 341
C3 H1 N008 2.2n
C4 N009 N008 2.2n
R3 H1 N009 6.4k
V1 N007 0 AC 1 0
V2 0 Vee 15
V3 Vcc 0 15
X§U1 0 N009 Vcc Vee H1 TL082  ; pins In+ In- V+ V- OUT
R4 N011 N010 3.53k
R5 0 N011 404
C1 H2 N011 2.2n
C2 N012 N011 2.2n
R6 H2 N012 7.58k
X§U2 0 N012 Vcc Vee H2 TL082  ; pins In+ In- V+ V- OUT
R7 N020 N019 2.53k
R8 0 N020 142
C5 H3 N020 2.2n
C6 N021 N020 2.2n
R9 H3 N021 11.2k
V5 N019 0 AC 1 0
X§U3 0 N021 Vcc Vee H3 TL082  ; pins In+ In- V+ V- OUT
R10 N023 N022 3.89k
R11 0 N023 218
C7 H4 N023 2.2n
C8 N024 N023 2.2n
R12 H4 N024 17.3k
V6 N022 0 AC 1 0
X§U4 0 N024 Vcc Vee H4 TL082  ; pins In+ In- V+ V- OUT
R13 N005 N004 3.25k
R14 0 N005 327
C9 H1. N005 2.04n
C10 N006 N005 2.33n
R15 H1. N006 5.5k
V7 N004 0 AC 1 0
X§U5 0 N006 Vcc Vee H1. TL082  ; pins In+ In- V+ V- OUT
R16 N002 N001 3.85k
R17 0 N002 385
C11 H2. N002 1.97n
C12 N003 N002 2.01n
R18 H2. N003 9.5k
X§U6 0 N003 Vcc Vee H2. TL082  ; pins In+ In- V+ V- OUT
R19 N017 N016 2.65k
R20 0 N017 149
C13 H3. N017 2.05n
C14 N018 N017 2.2n
R21 H3. N018 11k
V4 N016 0 AC 1 0
X§U7 0 N018 Vcc Vee H3. TL082  ; pins In+ In- V+ V- OUT
R22 N014 N013 3.83k
R23 0 N014 218
C15 H4. N014 2.2n
C16 N015 N014 2.2n
R24 H4. N015 17k
V8 N013 0 AC 1 0
X§U8 0 N015 Vcc Vee H4. TL082  ; pins In+ In- V+ V- OUT
V9 N010 0 AC 1 0
R25 N034 N033 2.98k
R26 0 N034 341
C17 N032 N034 2.2n
C18 N035 N034 2.2n
R27 N032 N035 6.4k
V10 N033 0 AC 1 0
X§U9 0 N035 Vcc Vee N032 TL082  ; pins In+ In- V+ V- OUT
R28 N036 N032 3.53k
R29 0 N036 404
C19 Hi N036 2.2n
C20 N037 N036 2.2n
R30 Hi N037 7.58k
X§U10 0 N037 Vcc Vee Hi TL082  ; pins In+ In- V+ V- OUT
R31 N044 Hi 2.53k
R32 0 N044 142
C21 N043 N044 2.2n
C22 N045 N044 2.2n
R33 N043 N045 11.2k
X§U11 0 N045 Vcc Vee N043 TL082  ; pins In+ In- V+ V- OUT
R34 N046 N043 3.89k
R35 0 N046 218
C23 Hf N046 2.2n
C24 N047 N046 2.2n
R36 Hf N047 17.3k
X§U12 0 N047 Vcc Vee Hf TL082  ; pins In+ In- V+ V- OUT
V11 N001 0 AC 1 0
R37 N028 N027 3.25k
R38 0 N028 327
C25 N026 N028 2.04n
C26 N029 N028 2.33n
R39 N026 N029 5.5k
V12 N027 0 SINE(0 1 47.5k) AC 1 0
X§U13 0 N029 Vcc Vee N026 TL082  ; pins In+ In- V+ V- OUT
R40 N030 N026 2.65k
R41 0 N030 149
C27 Hi. N030 2.05n
C28 N031 N030 2.2n
R42 Hi. N031 11k
X§U14 0 N031 Vcc Vee Hi. TL082  ; pins In+ In- V+ V- OUT
R43 N039 Hi. 3.85k
R44 0 N039 385
C29 N038 N039 1.97n
C30 N040 N039 2.01n
R45 N038 N040 9.5k
X§U15 0 N040 Vcc Vee N038 TL082  ; pins In+ In- V+ V- OUT
R46 N041 N038 3.83k
R47 0 N041 218
C31 Hf. N041 2.2n
C32 N042 N041 2.2n
X§U16 0 N042 Vcc Vee Hf. TL082  ; pins In+ In- V+ V- OUT
R48 Hf. N042 17k
R49 N050 N049 1849
R50 0 N050 159
C33 N048 N050 2.2n
C34 N051 N050 2.2n
R51 N048 N051 23382
V13 N049 0 SINE(0 1 47.5k) AC 1 0
X§U17 0 N051 Vcc Vee N048 TL082  ; pins In+ In- V+ V- OUT
R52 N052 N048 1653
R53 0 N052 458
C35 Hi. N052 2.2n
C36 N053 N052 2.2n
R54 Hi. N053 7625
X§U18 0 N053 Vcc Vee Hi. TL082  ; pins In+ In- V+ V- OUT
R55 N055 Hi. 1403
R56 0 N055 481
C37 N054 N055 2.2n
C38 N056 N055 2.2n
R57 N054 N056 5491
X§U19 0 N056 Vcc Vee N054 TL082  ; pins In+ In- V+ V- OUT
R58 N057 N054 1254
R59 0 N057 165
C39 Hf. N057 2.2n
C40 N058 N057 2.2n
X§U20 0 N058 Vcc Vee Hf. TL082  ; pins In+ In- V+ V- OUT
R60 Hf. N058 10764
.include "C:\Users\pojeu\Desktop\École\A25\ELE2003\ELE2003_Table15\LesLTspice\TL082.lib\TL082.301"
.ac dec 200 100 100k
* Théorique
* Réel
* Théorique assemblé
* Réel assemblé
* .tran 100us
.backanno
.end

* Results of the author's LTspice run, read from the files saved beside the schematic
* Operating Point, zero values left out:
*   V(vee) = -15 V
*   V(h3) = 11.48 µV
*   V(n024) = 10.97 µV
*   V(n003) = 10.97 µV
*   V(n015) = 10.97 µV
*   V(n036) = 1.156 µV
*   V(n047) = 10.97 µV
*   V(n042) = 10.83 µV
*   V(n054) = 11.22 µV
*   V(n030) = 597.2 nV
*   V(n012) = 10.97 µV
*   V(n045) = 10.97 µV
*   V(n040) = 10.97 µV
*   V(n052) = 2.609 µV
*   V(n037) = 10.97 µV
*   V(n031) = 10.89 µV
*   V(n057) = 1.304 µV
*   V(n009) = 10.97 µV
*   V(h2.) = 11.4 µV
*   V(h4.) = 11.74 µV
*   V(n035) = 10.97 µV
*   V(hf) = 11.75 µV
*   V(hf.) = 11.6 µV
*   V(n055) = 2.908 µV
*   V(n018) = 10.97 µV
*   V(h2) = 11.31 µV
*   V(h4) = 11.75 µV
*   V(n006) = 10.97 µV
*   V(n043) = 11.48 µV
*   V(n029) = 10.97 µV
*   V(n038) = 11.4 µV
*   V(n051) = 10.97 µV
*   V(vcc) = 15 V
*   V(n021) = 10.97 µV
*   V(hi) = 11.31 µV
*   V(n056) = 10.97 µV
*   V(h1) = 11.26 µV
*   V(n032) = 11.26 µV
*   V(n046) = 609 nV
*   V(hi.) = 11.39 µV
*   V(n041) = 613.9 nV
*   V(n053) = 11.05 µV
*   V(h3.) = 11.47 µV
*   V(h1.) = 11.22 µV
*   V(n044) = 601.2 nV
*   V(n026) = 11.22 µV
*   V(n039) = 1.035 µV
*   V(n048) = 12.02 µV
*   V(n058) = 11.11 µV
*   I(R39) = 45.05 pA
*   I(R42) = 45.05 pA
*   I(R9) = 45.05 pA
*   I(R48) = 45.05 pA
*   I(R15) = 45.05 pA
*   I(R12) = 45.05 pA
*   I(R18) = 45.05 pA
*   I(R59) = -7.906 nA
*   I(R41) = -4.008 nA
*   I(R55) = -6.046 nA
*   I(R31) = -4.234 nA
*   I(R35) = -2.793 nA
*   I(R27) = 45.05 pA
*   I(R54) = 45.05 pA
*   I(R30) = 45.05 pA
*   I(R51) = 45.05 pA
*   I(R46) = -2.816 nA
*   I(R60) = 45.05 pA
*   I(V3) = -283.9 mA
*   I(R29) = -2.862 nA
*   I(R53) = -5.696 nA
*   I(R45) = 45.05 pA
*   I(R3) = 45.05 pA
*   I(R58) = -7.906 nA
*   I(R40) = -4.008 nA
*   I(R21) = 45.05 pA
*   I(R34) = -2.793 nA
*   I(R24) = 45.05 pA
*   I(R44) = -2.69 nA
*   I(R33) = 45.05 pA
*   I(R57) = 45.05 pA
*   I(R6) = 45.05 pA
*   I(R28) = -2.862 nA
*   I(V2) = -283.9 mA
*   I(R32) = -4.234 nA
*   I(R52) = -5.696 nA
*   I(R56) = -6.046 nA
*   I(R47) = -2.816 nA
*   I(R36) = 45.05 pA
*   I(R43) = -2.69 nA
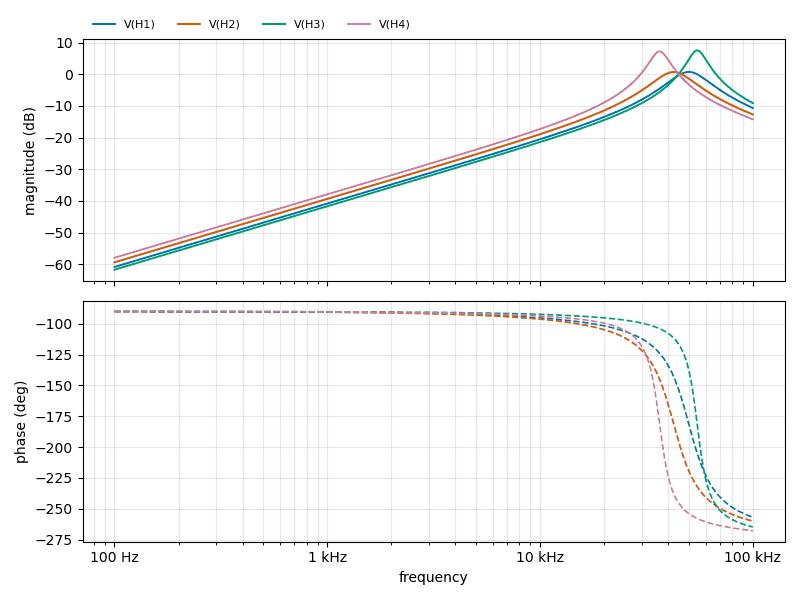
[diagram p3: AC Analysis of Filtres separes_F_wizard.asc, plotted from the saved traces]
* AC Analysis, 1 run:
*   V(H1): -60.83 dB at 100 Hz, -10.65 dB at 100 kHz, peak 0.76 dB at 50.12 kHz, 3 dB below the peak at 40.66 kHz and 61.51 kHz
*   V(H2): -59.36 dB at 100 Hz, -12.69 dB at 100 kHz, peak 0.72 dB at 42.66 kHz, 3 dB below the peak at 34.43 kHz and 52.3 kHz
*   V(H3): -61.69 dB at 100 Hz, -9.09 dB at 100 kHz, peak 7.54 dB at 54.95 kHz, 3 dB below the peak at 49.85 kHz and 60.24 kHz
*   V(H4): -57.93 dB at 100 Hz, -14.20 dB at 100 kHz, peak 7.21 dB at 36.31 kHz, 3 dB below the peak at 32.97 kHz and 40.34 kHz